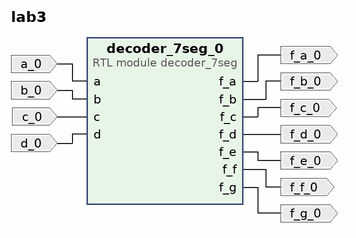
[diagram p0: block diagram of the top level]
# Vivado block design lab3, xc7a35tcpg236-1, Vivado 2018.2
create_bd_design lab3

create_bd_port -dir I a_0
create_bd_port -dir I b_0
create_bd_port -dir I c_0
create_bd_port -dir I d_0
create_bd_port -dir O f_a_0
create_bd_port -dir O f_b_0
create_bd_port -dir O f_c_0
create_bd_port -dir O f_d_0
create_bd_port -dir O f_e_0
create_bd_port -dir O f_f_0
create_bd_port -dir O f_g_0

create_bd_cell -type module -reference decoder_7seg decoder_7seg_0

# ---- connections ----

connect_bd_net -net a_0_1 [get_bd_ports a_0] [get_bd_pins decoder_7seg_0/a]
connect_bd_net -net b_0_1 [get_bd_ports b_0] [get_bd_pins decoder_7seg_0/b]
connect_bd_net -net c_0_1 [get_bd_ports c_0] [get_bd_pins decoder_7seg_0/c]
connect_bd_net -net d_0_1 [get_bd_ports d_0] [get_bd_pins decoder_7seg_0/d]
connect_bd_net [get_bd_pins decoder_7seg_0/f_a] [get_bd_ports f_a_0]
connect_bd_net [get_bd_pins decoder_7seg_0/f_b] [get_bd_ports f_b_0]
connect_bd_net [get_bd_pins decoder_7seg_0/f_c] [get_bd_ports f_c_0]
connect_bd_net [get_bd_pins decoder_7seg_0/f_d] [get_bd_ports f_d_0]
connect_bd_net [get_bd_pins decoder_7seg_0/f_e] [get_bd_ports f_e_0]
connect_bd_net [get_bd_pins decoder_7seg_0/f_f] [get_bd_ports f_f_0]
connect_bd_net [get_bd_pins decoder_7seg_0/f_g] [get_bd_ports f_g_0]

validate_bd_design
save_bd_design
